# EAGLE design ArachnioDue (EAGLE 6.5.0)

## Sheet 1 of 4
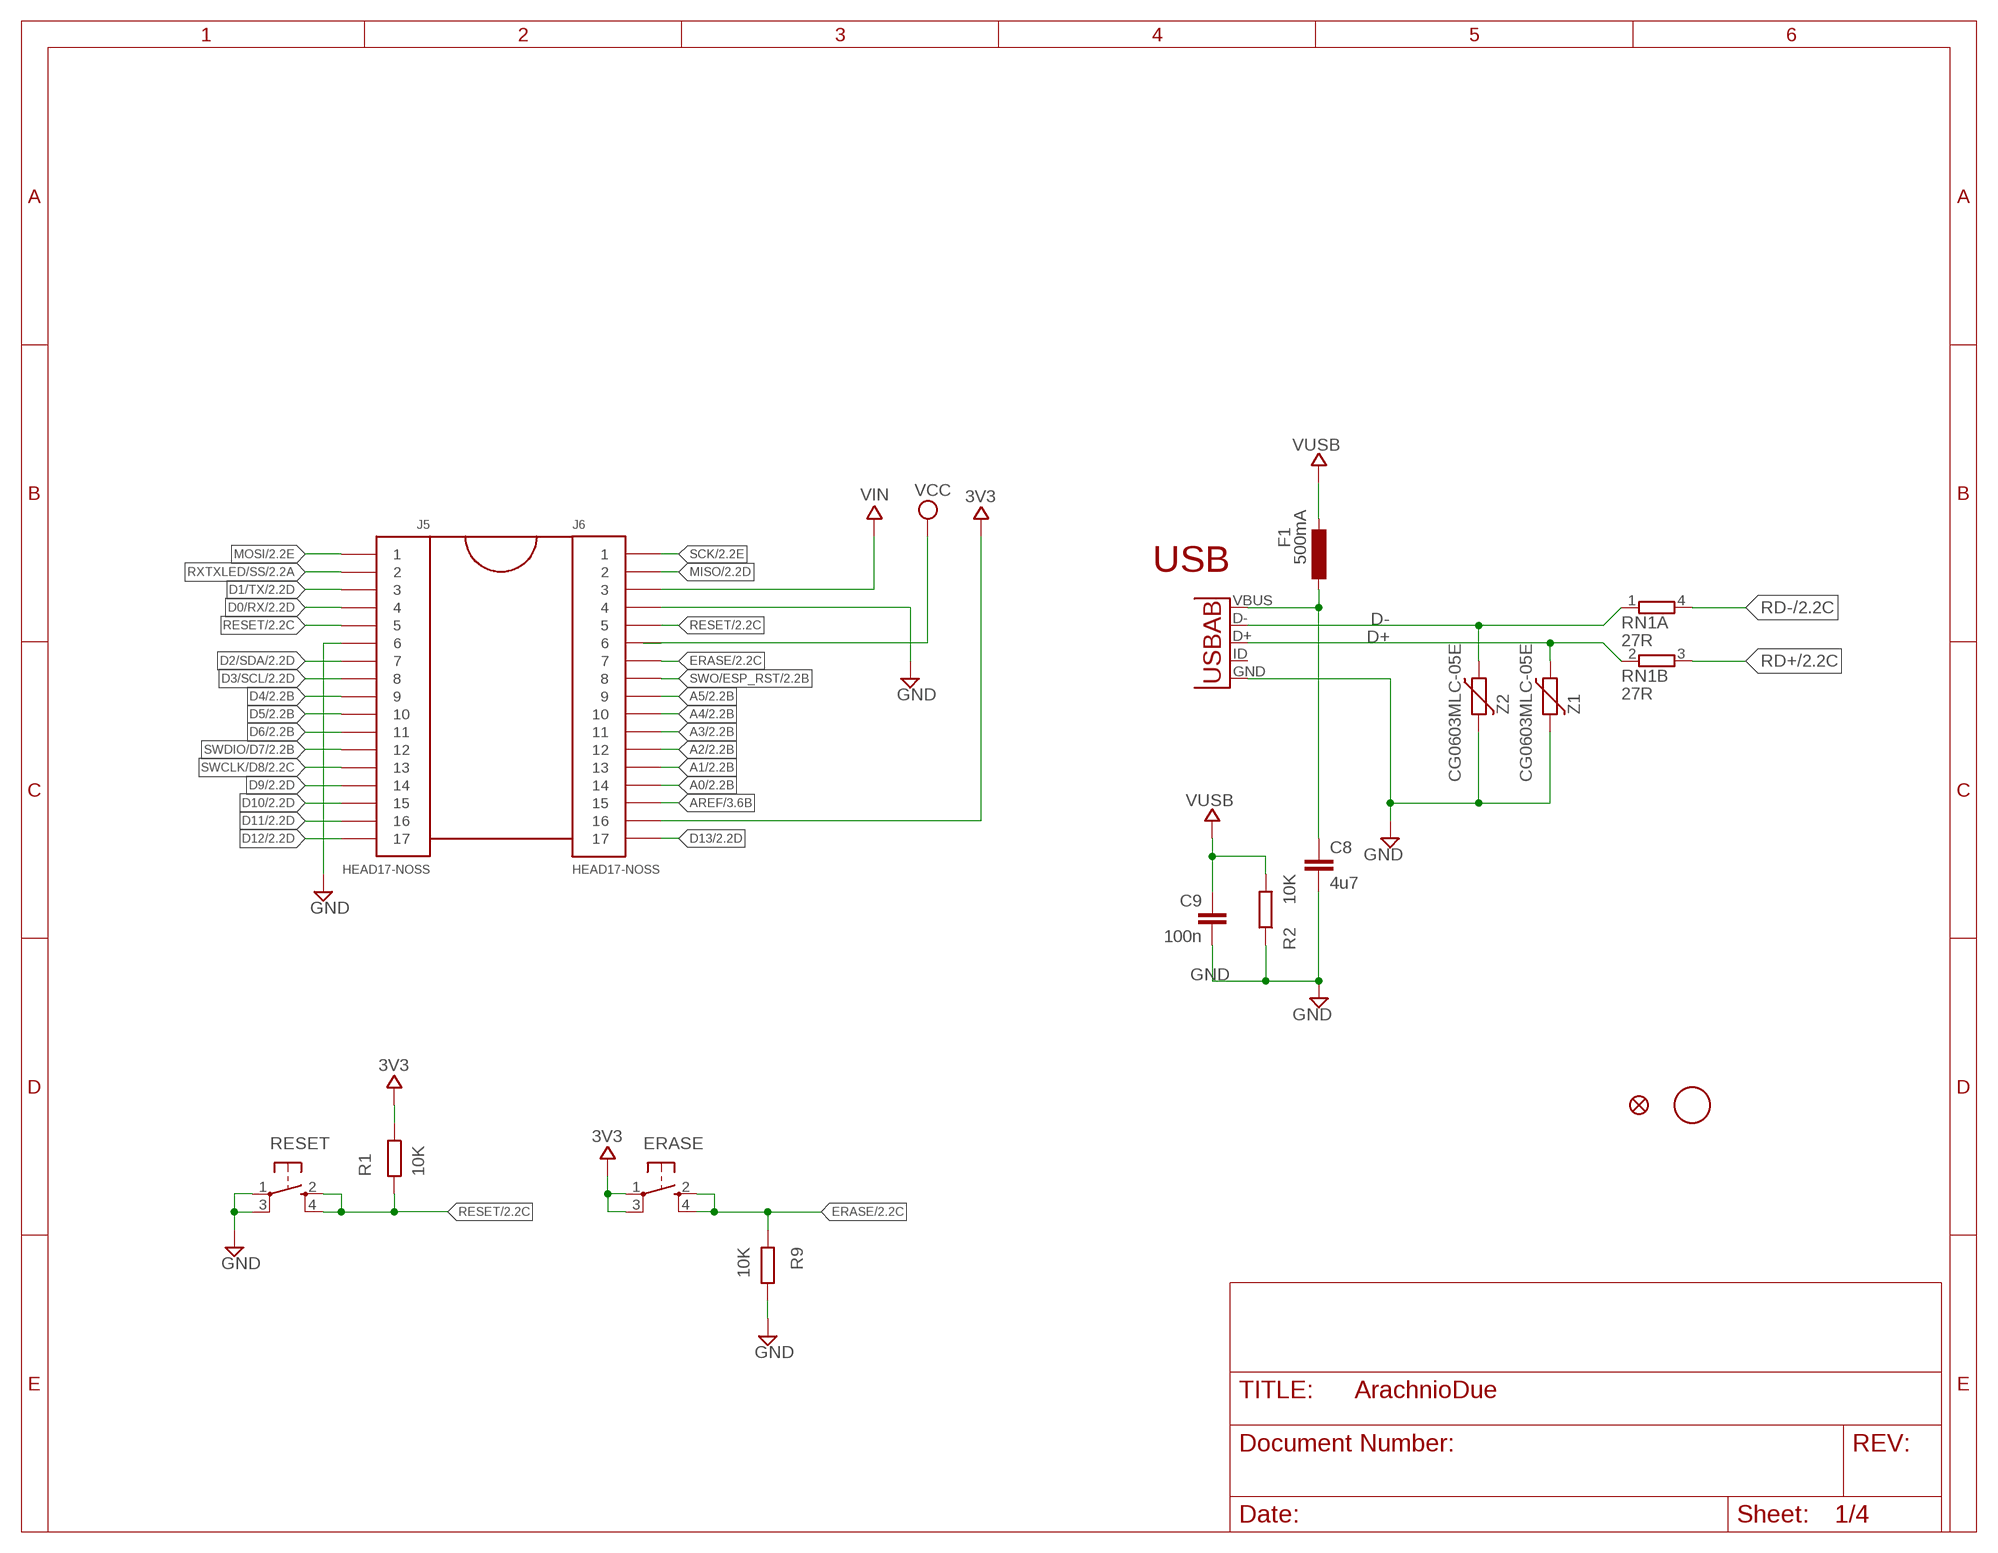
[diagram p0: schematic, sheet 1]

### Parts
C8  4u7  C-EUC0603  [C0603]
C9  100n  C-EUC0603  [C0603]
CN1  USB-AB  [USB-AB-MICRO-SMD]
ERASE  SPST_TACT-KMR2  [KMR2]
F1  500mA  L-EUL1812  [L1812]
J5  HEAD17-NOSS  [HEAD17-NOSS]
J6  HEAD17-NOSS  HEAD17-NOSS-1  [HEAD17-NOSS-1]
R1  10K  R-EU_R0402  [R0402]
R2  10K  R-EU_R0402  [R0402]
R9  10K  R-EU_R0402  [R0402]
RESET  SPST_TACT-KMR2  [KMR2]
RN1  27R  2R-NEXBV4V  [EXBV4V]
U$37  FIDUCIALMOUNT  [FIDUCIA-MOUNT]
U$53  FIDUCIAL1X2  [FIDUCIAL-1X2]
Z1  CG0603MLC-05E  VARISTORCN0603  [CT/CN0603]
Z2  CG0603MLC-05E  VARISTORCN0603  [CT/CN0603]

### Nets
3V3: ERASE.1(P) ERASE.3(P1) J6.16 R1.1 ; also sheet 2,3,4
A0: J6.14 ; also sheet 2
A1: J6.13 ; also sheet 2
A2: J6.12 ; also sheet 2
A3: J6.11 ; also sheet 2
A4: J6.10 ; also sheet 2
A5: J6.9 ; also sheet 2
AREF: J6.15 ; also sheet 3
D0/RX: J5.4 ; also sheet 2,4
D1/TX: J5.3 ; also sheet 2,4
D2/SDA: J5.7 ; also sheet 2
D3/SCL: J5.8 ; also sheet 2,4
D4: J5.9 ; also sheet 2
D5: J5.10 ; also sheet 2
D6: J5.11 ; also sheet 2
D9: J5.14 ; also sheet 2
D10: J5.15 ; also sheet 2
D11: J5.16 ; also sheet 2
D12: J5.17 ; also sheet 2
D13: J6.17 ; also sheet 2
D+: CN1.D+ RN1.2 Z1.1
D-: CN1.D- RN1.1 Z2.1
ERASE: ERASE.2(S) ERASE.4(S1) J6.7 R9.2 ; also sheet 2
GND: C8.2 C9.2 CN1.GND J5.6 J6.4 R2.1 R9.1 RESET.1(P) RESET.3(P1) Z1.2 Z2.2 ; also sheet 2,3,4
MISO: J6.2 ; also sheet 2
MOSI: J5.1 ; also sheet 2
RD+: RN1.3 ; also sheet 2
RD-: RN1.4 ; also sheet 2
RESET: J5.5 J6.5 R1.2 RESET.2(S) RESET.4(S1) ; also sheet 2,4
RXTXLED/SS: J5.2 ; also sheet 2
SCK: J6.1 ; also sheet 2
SWCLK/D8: J5.13 ; also sheet 2
SWDIO/D7: J5.12 ; also sheet 2
SWO/ESP_RST: J6.8 ; also sheet 2,4
VCC: J6.6 ; also sheet 3
VIN: J6.3 ; also sheet 3
VUSB: C9.1 F1.2 R2.2 ; also sheet 3
VUSBD: C8.1 CN1.VBUS F1.1
Unconnected: CN1.ID(USBID)

### Notes on the sheet
- USB

## Sheet 2 of 4
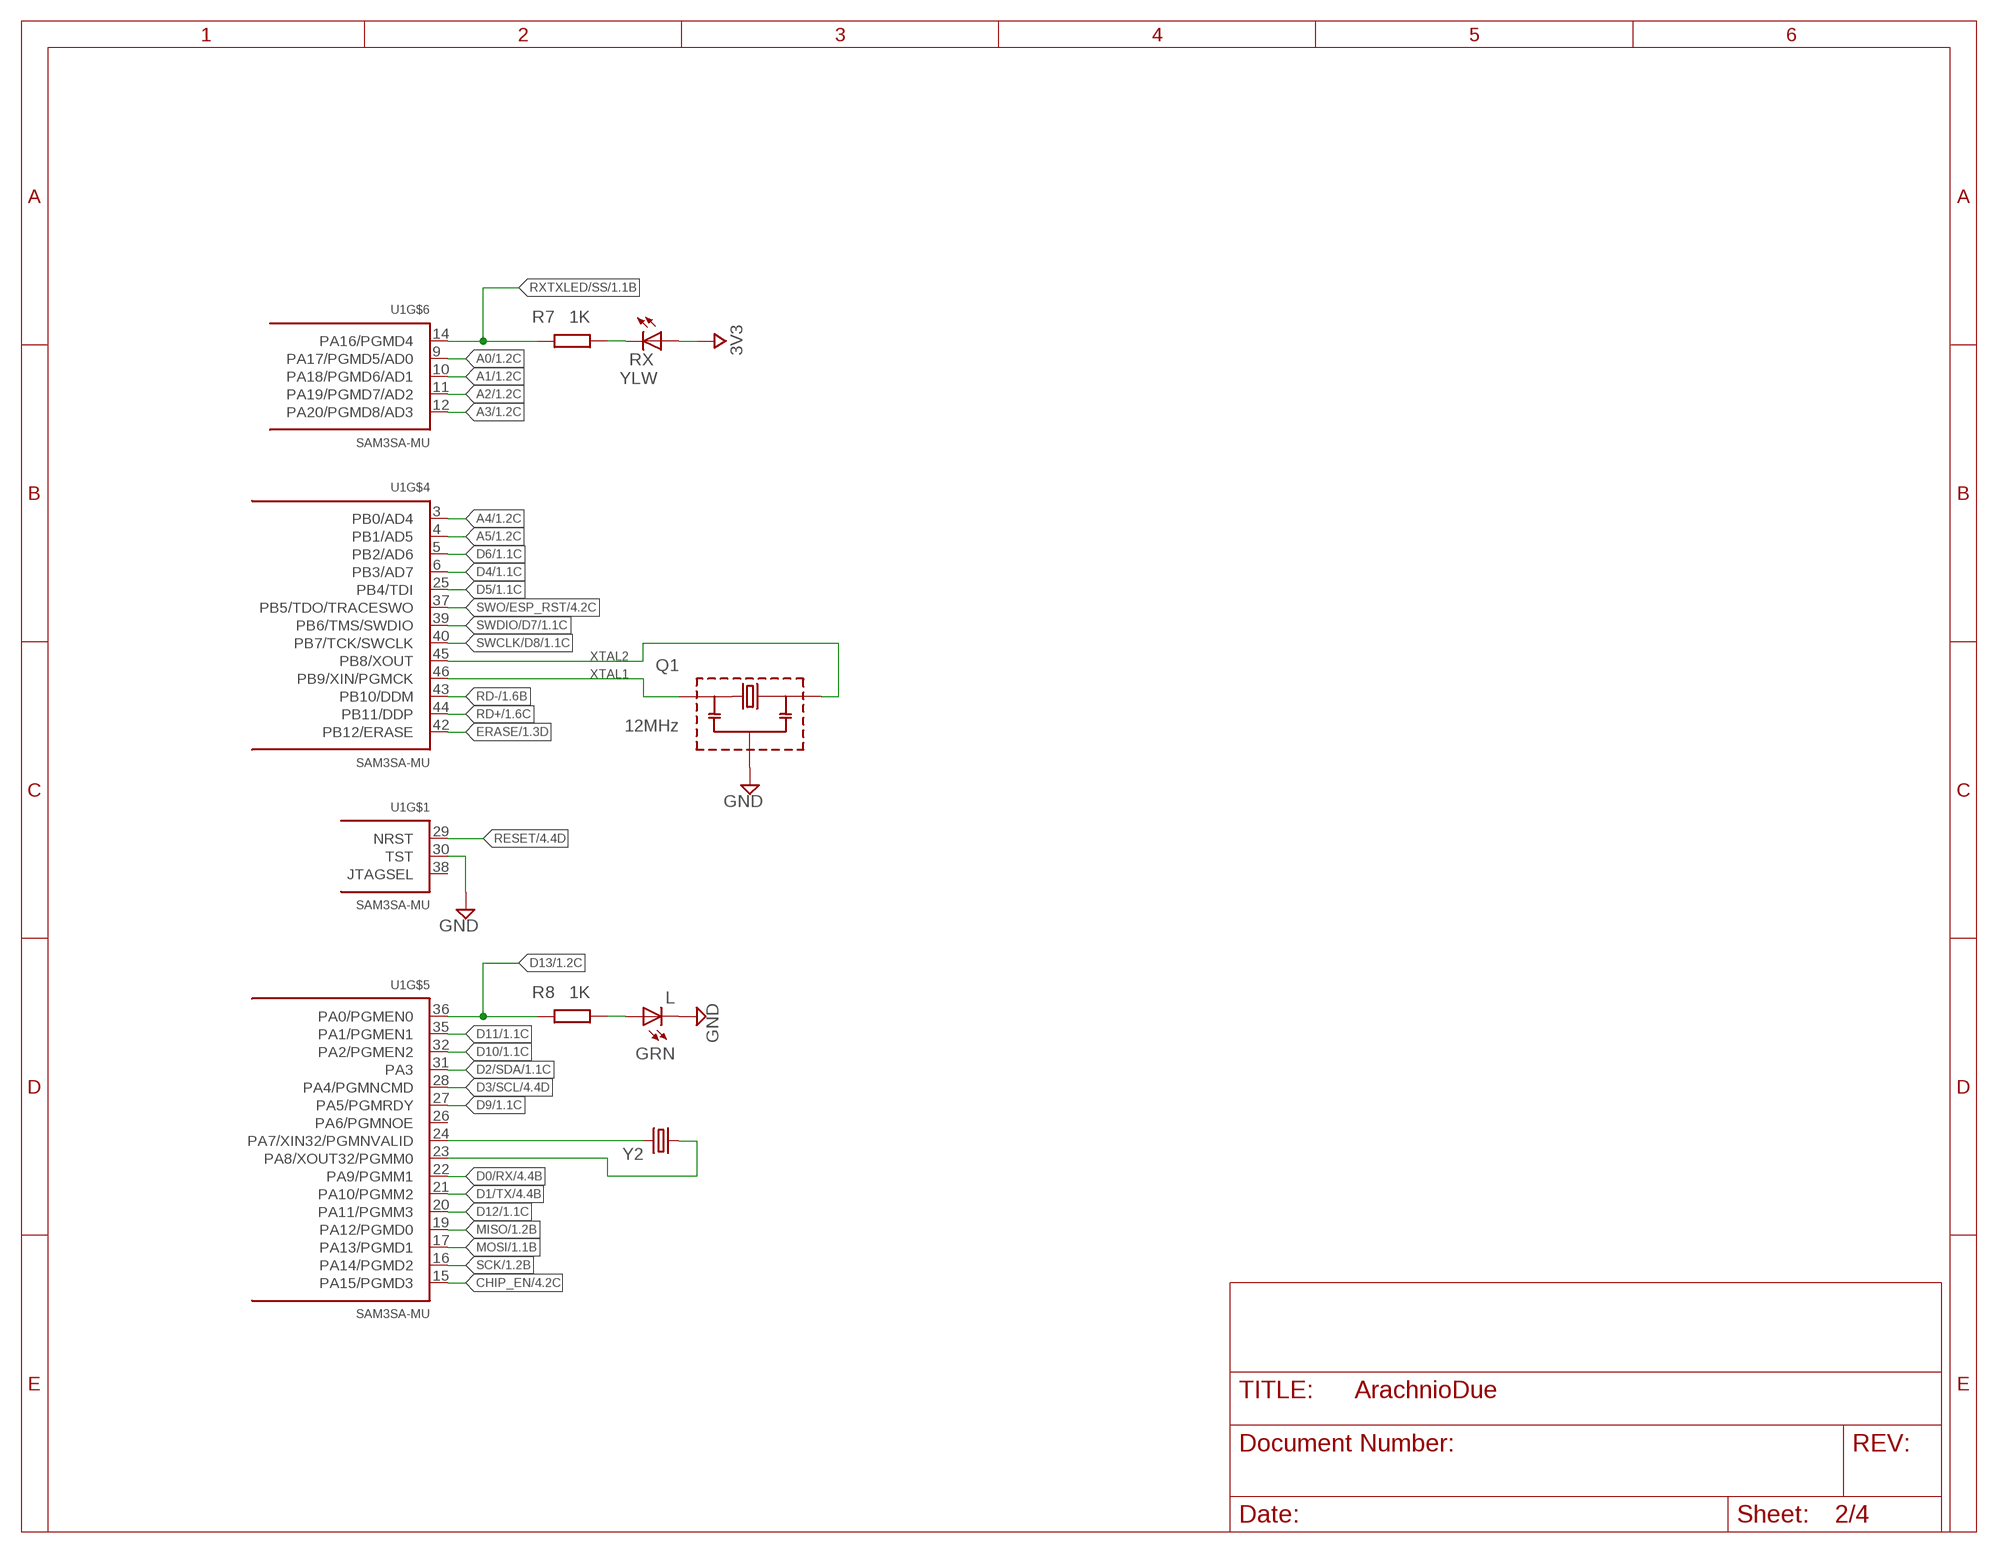
[diagram p1: schematic, sheet 2]

### Parts
L  GRN  LEDCHIP-LED0603  [CHIP-LED0603]
Q1  12MHz  PRQC  [PRQC]
R7  1K  R-EU_R0402  [R0402]
R8  1K  R-EU_R0402  [R0402]
RX  YLW  LEDCHIP-LED0603  [CHIP-LED0603]
U1  SAM3SA-MU  [QFN48]
Y2  CRYSTALEPSONMC146  [CRYSTAL-32KHZ-SMD_EPSON_MC146]

### Nets
3V3: RX.A ; also sheet 1,3,4
A0: U1.9(PA17/PGMD5/AD0) ; also sheet 1
A1: U1.10(PA18/PGMD6/AD1) ; also sheet 1
A2: U1.11(PA19/PGMD7/AD2) ; also sheet 1
A3: U1.12(PA20/PGMD8/AD3) ; also sheet 1
A4: U1.3(PB0/AD4) ; also sheet 1
A5: U1.4(PB1/AD5) ; also sheet 1
CHIP_EN: U1.15(PA15/PGMD3) ; also sheet 4
D0/RX: U1.22(PA9/PGMM1) ; also sheet 1,4
D1/TX: U1.21(PA10/PGMM2) ; also sheet 1,4
D2/SDA: U1.31(PA3) ; also sheet 1
D3/SCL: U1.28(PA4/PGMNCMD) ; also sheet 1,4
D4: U1.6(PB3/AD7) ; also sheet 1
D5: U1.25(PB4/TDI) ; also sheet 1
D6: U1.5(PB2/AD6) ; also sheet 1
D9: U1.27(PA5/PGMRDY) ; also sheet 1
D10: U1.32(PA2/PGMEN2) ; also sheet 1
D11: U1.35(PA1/PGMEN1) ; also sheet 1
D12: U1.20(PA11/PGMM3) ; also sheet 1
D13: R8.1 U1.36(PA0/PGMEN0) ; also sheet 1
ERASE: U1.42(PB12/ERASE) ; also sheet 1
GND: L.C Q1.P$2 U1.30(TST) ; also sheet 1,3,4
MISO: U1.19(PA12/PGMD0) ; also sheet 1
MOSI: U1.17(PA13/PGMD1) ; also sheet 1
N$1: U1.23(PA8/XOUT32/PGMM0) Y2.P$2
N$2: R7.2 RX.C
N$5: U1.24(PA7/XIN32/PGMNVALID) Y2.P$1
N$7: L.A R8.2
RD+: U1.44(PB11/DDP) ; also sheet 1
RD-: U1.43(PB10/DDM) ; also sheet 1
RESET: U1.29(NRST) ; also sheet 1,4
RXTXLED/SS: R7.1 U1.14(PA16/PGMD4) ; also sheet 1
SCK: U1.16(PA14/PGMD2) ; also sheet 1
SWCLK/D8: U1.40(PB7/TCK/SWCLK) ; also sheet 1
SWDIO/D7: U1.39(PB6/TMS/SWDIO) ; also sheet 1
SWO/ESP_RST: U1.37(PB5/TDO/TRACESWO) ; also sheet 1,4
XTAL1: Q1.P$3 U1.46(PB9/XIN/PGMCK)
XTAL2: Q1.P$1 U1.45(PB8/XOUT)
Unconnected: U1.26(PA6/PGMNOE) U1.38(JTAGSEL)

## Sheet 3 of 4
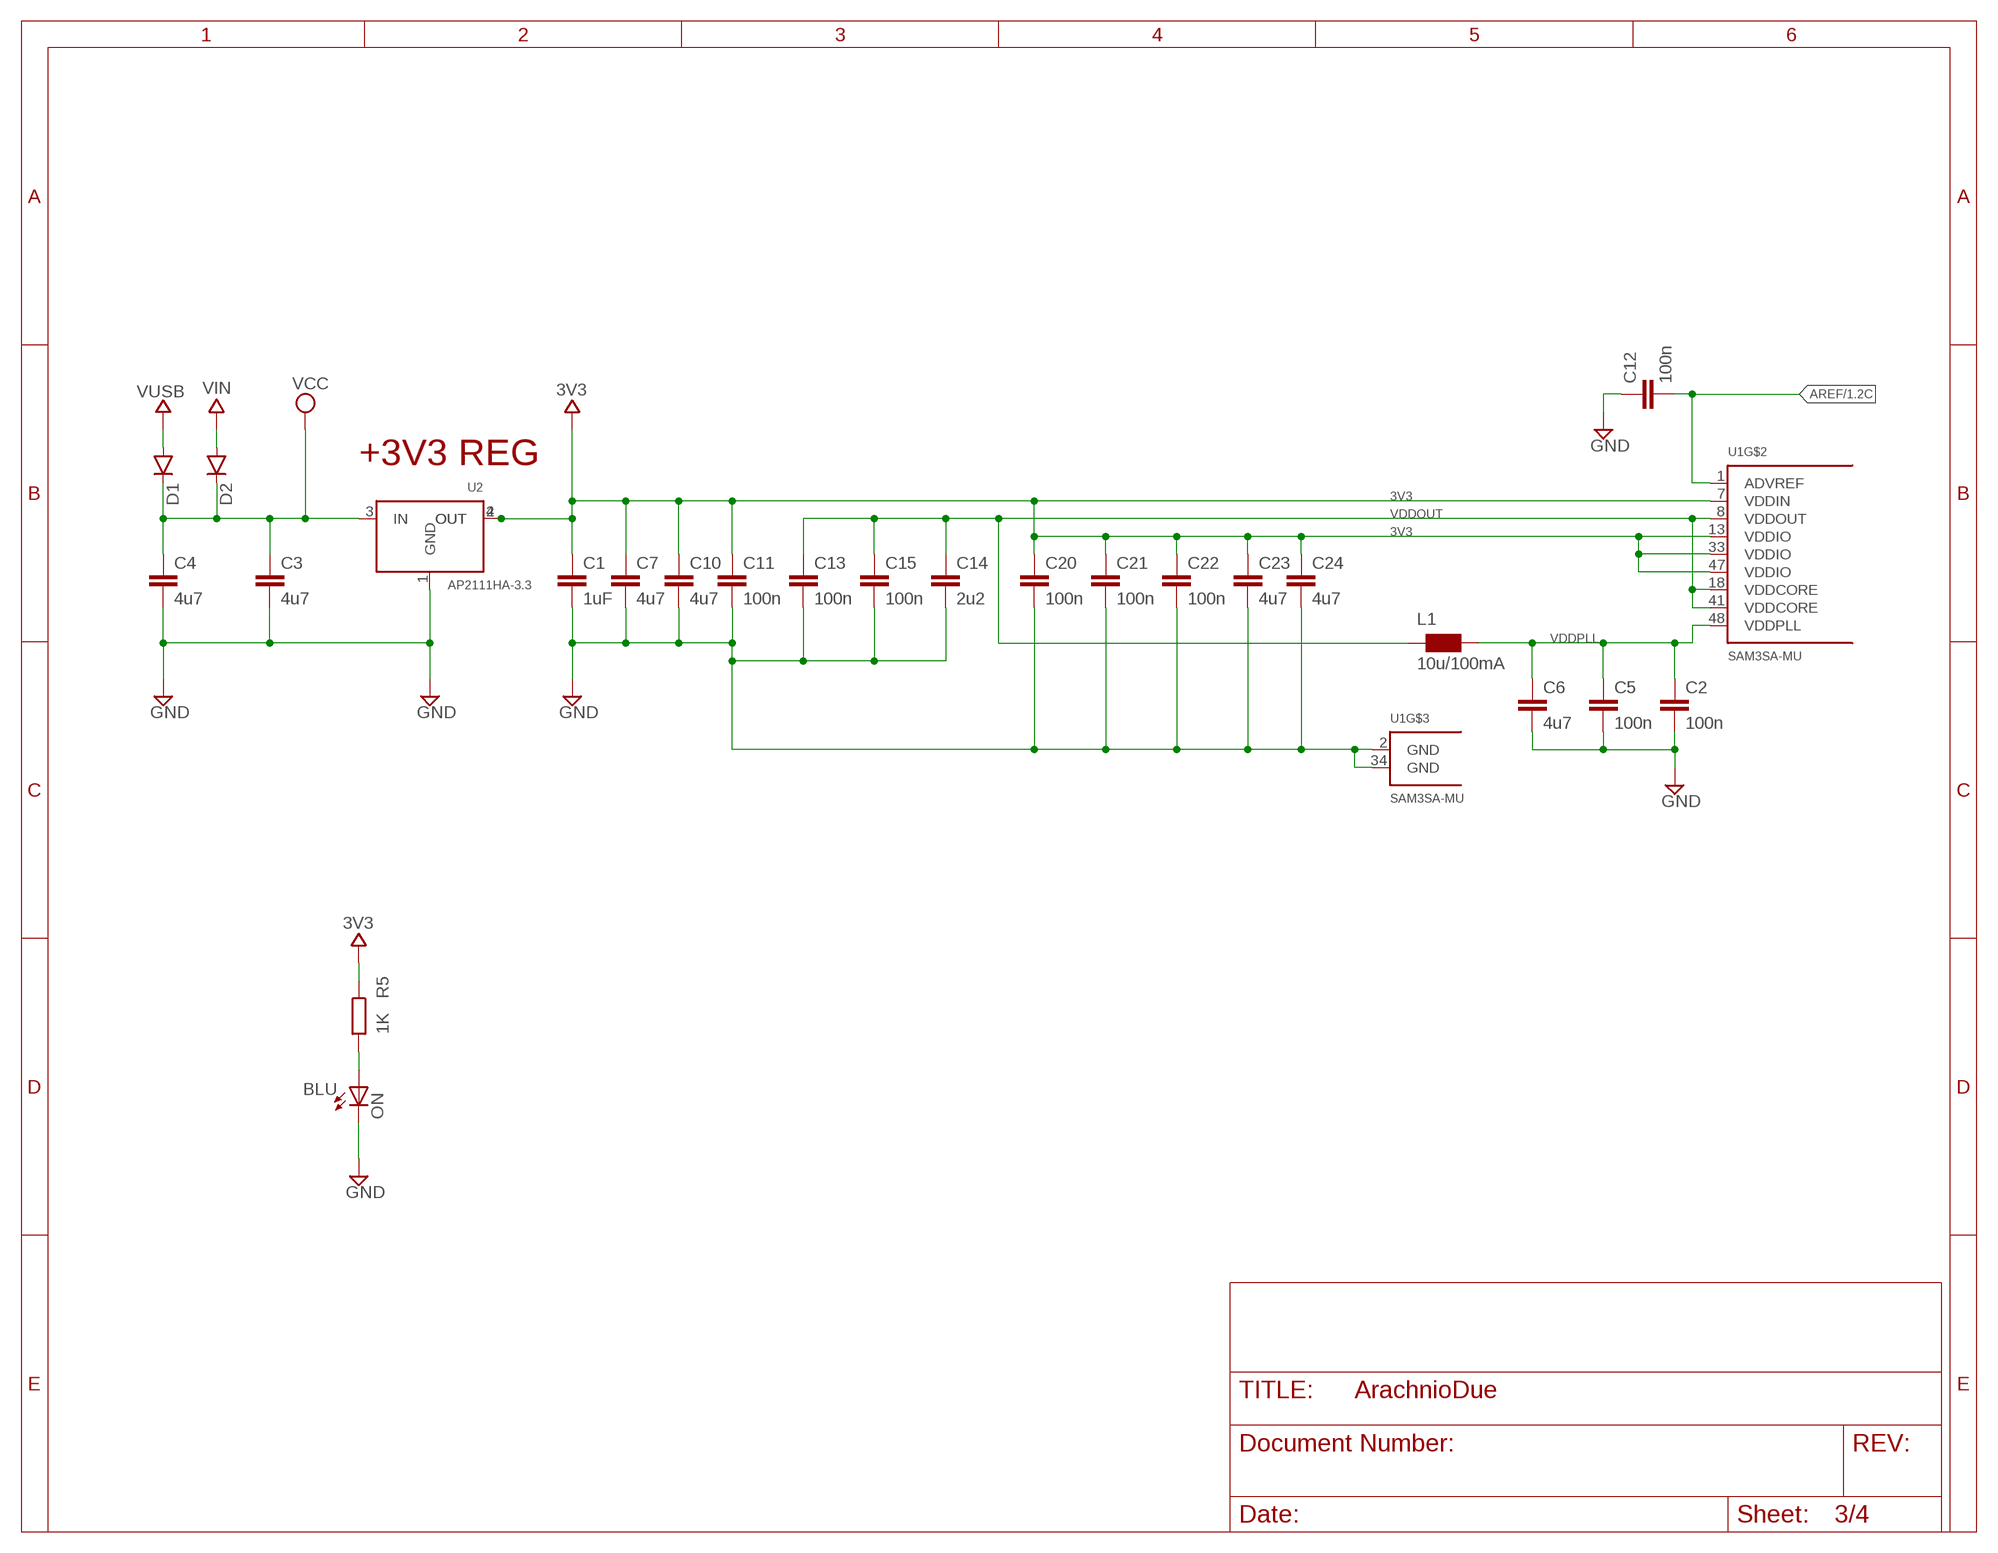
[diagram p2: schematic, sheet 3]

### Parts
C1  1uF  C-EUC0603  [C0603]
C2  100n  C-EUC0402  [C0402]
C3  4u7  C-EUC0603  [C0603]
C4  4u7  C-EUC0603  [C0603]
C5  100n  C-EUC0402  [C0402]
C6  4u7  C-EUC0603  [C0603]
C7  4u7  C-EUC0603  [C0603]
C10  4u7  C-EUC0603  [C0603]
C11  100n  C-EUC0402  [C0402]
C12  100n  C-EUC0402  [C0402]
C13  100n  C-EUC0402  [C0402]
C14  2u2  C-EUC0603  [C0603]
C15  100n  C-EUC0402  [C0402]
C20  100n  C-EUC0402  [C0402]
C21  100n  C-EUC0402  [C0402]
C22  100n  C-EUC0402  [C0402]
C23  4u7  C-EUC0603  [C0603]
C24  4u7  C-EUC0603  [C0603]
D1  DIODESOD123  [SOD-123]
D2  DIODESOD123  [SOD-123]
L1  10u/100mA  WE-CBF_0805  [0805]
ON  BLU  LEDCHIP-LED0603  [CHIP-LED0603]
R5  1K  R-EU_R0402  [R0402]
U2  AP2111HA-3.3  [SOT223]

### Nets
3V3: C1.1 C7.1 C10.1 C11.1 C20.1 C21.1 C22.1 C23.1 C24.1 R5.1 U1.7(VDDIN) U1.13(VDDIO) U1.33(VDDIO) U1.47(VDDIO) U2.2(OUT) U2.4(OUT) ; also sheet 1,2,4
AREF: C12.2 U1.1(ADVREF) ; also sheet 1
GND: C1.2 C2.2 C3.2 C4.2 C5.2 C6.2 C7.2 C10.2 C11.2 C12.1 C13.2 C14.2 C15.2 C20.2 C21.2 C22.2 C23.2 C24.2 ON.C U1.2(GND) U1.34(GND) U2.1(GND) ; also sheet 1,2,4
N$3: ON.A R5.2
VCC: C3.1 C4.1 D1.C D2.C U2.3(IN) ; also sheet 1
VDDOUT: C13.1 C14.1 C15.1 L1.1 U1.8(VDDOUT) U1.18(VDDCORE) U1.41(VDDCORE)
VDDPLL: C2.1 C5.1 C6.1 L1.2 U1.48(VDDPLL)
VIN: D2.A ; also sheet 1
VUSB: D1.A ; also sheet 1

### Notes on the sheet
- +3V3 REG

## Sheet 4 of 4
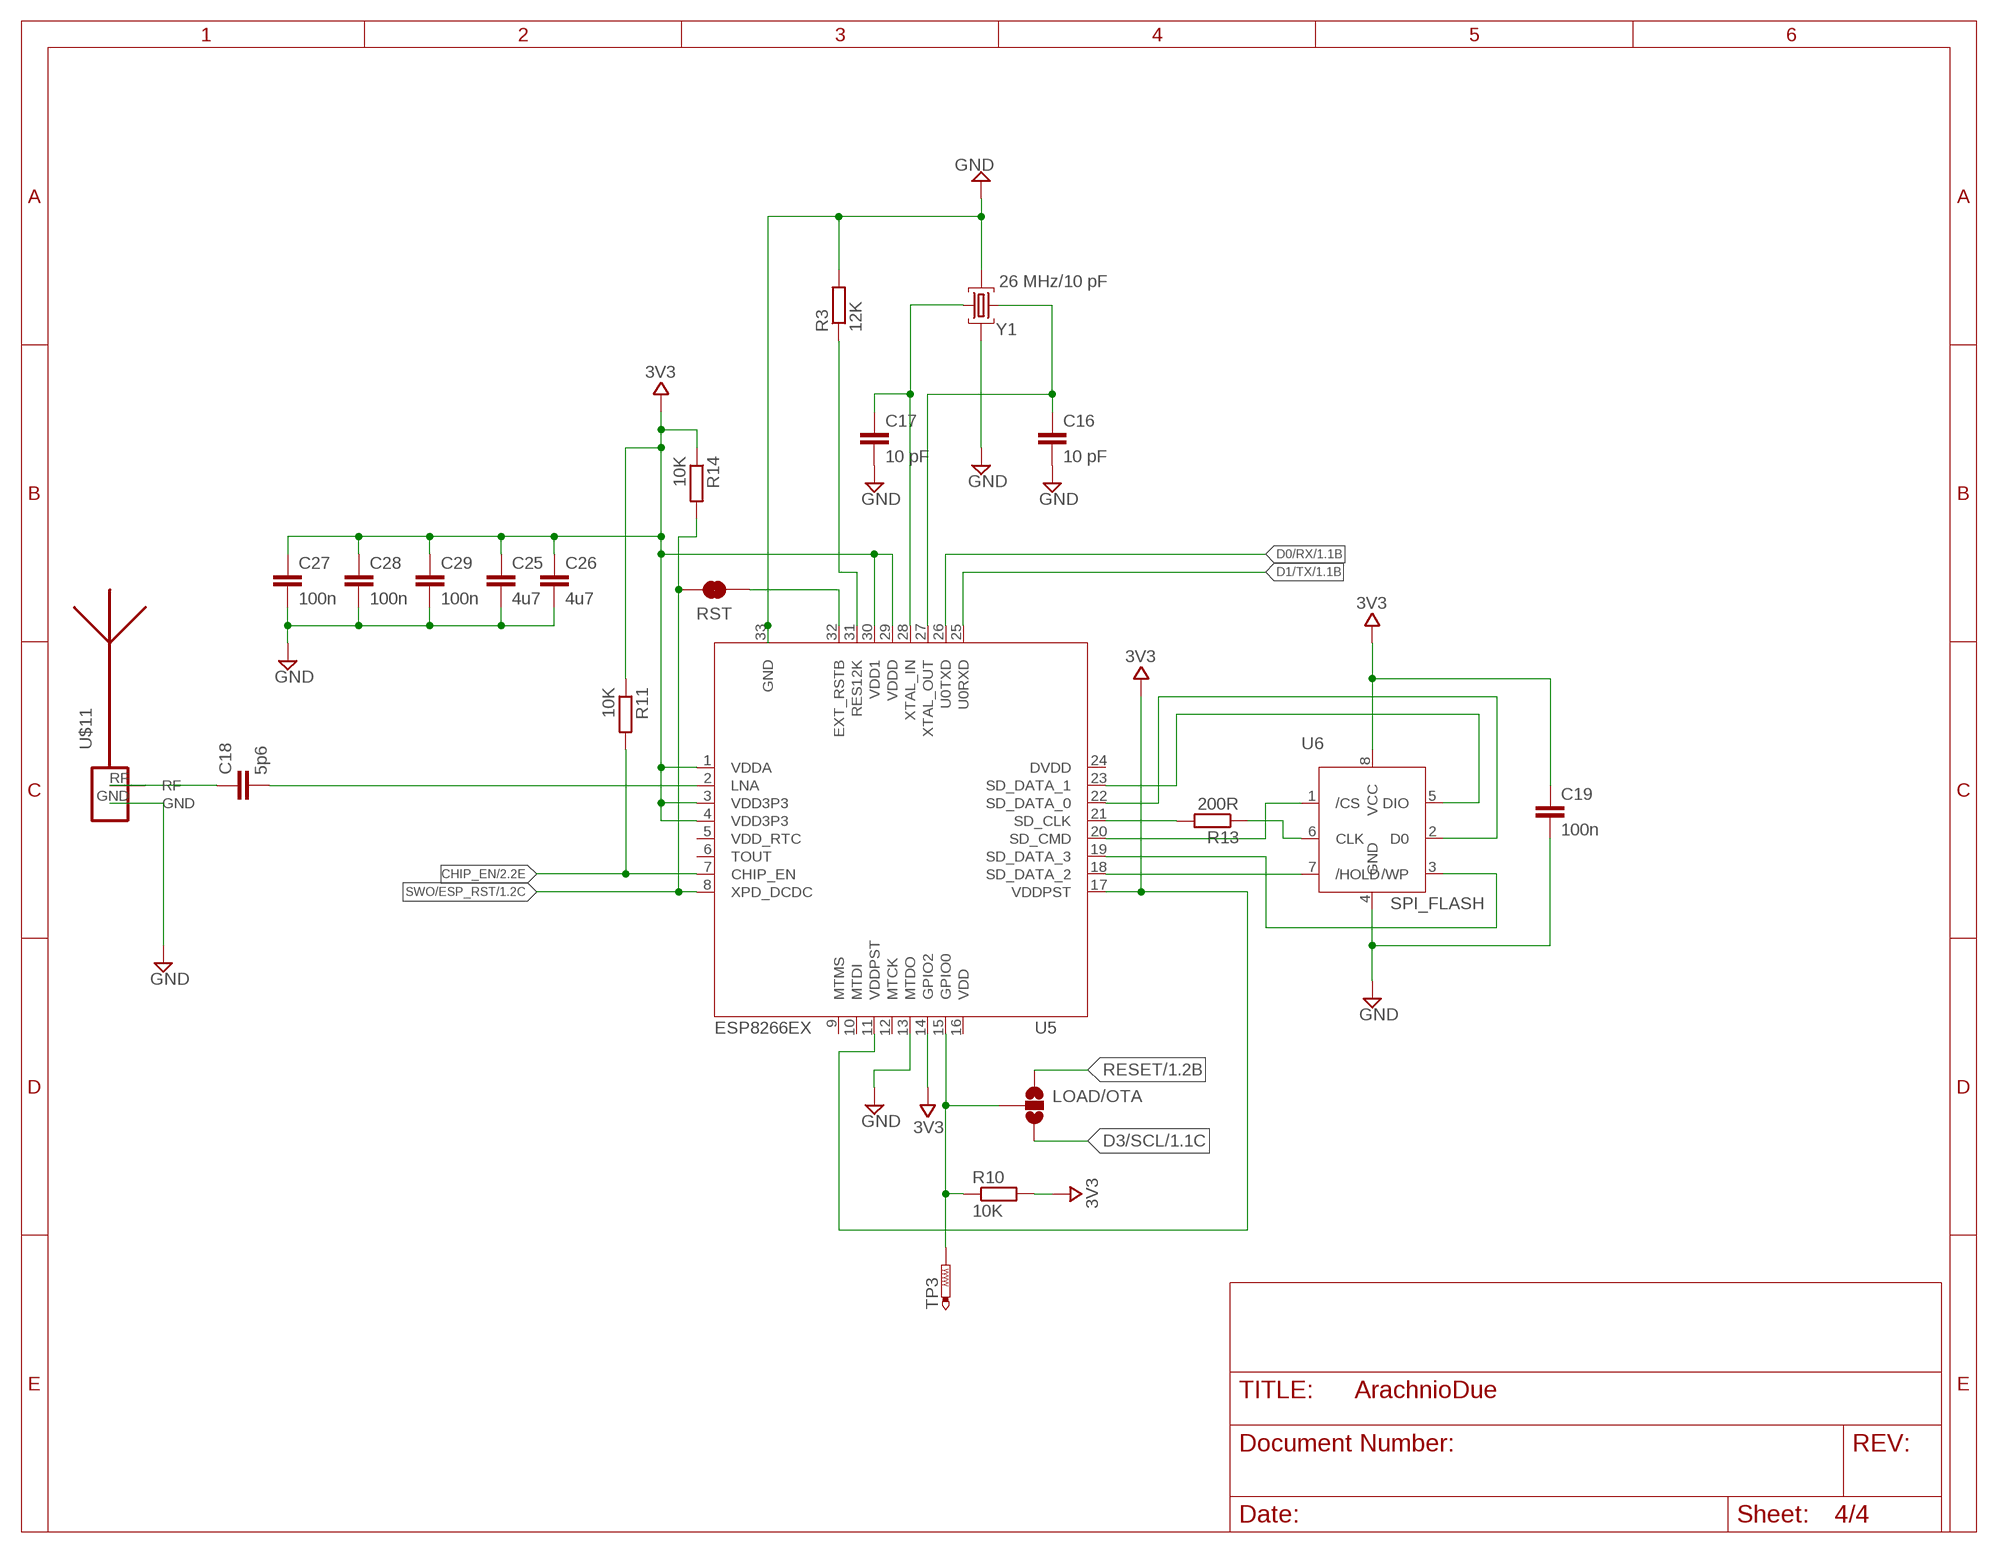
[diagram p3: schematic, sheet 4]

### Parts
C16  10 pF  C-EUC0402  [C0402]
C17  10 pF  C-EUC0402  [C0402]
C18  5p6  C-EUC0402  [C0402]
C19  100n  C-EUC0402  [C0402]
C25  4u7  C-EUC0603  [C0603]
C26  4u7  C-EUC0603  [C0603]
C27  100n  C-EUC0402  [C0402]
C28  100n  C-EUC0402  [C0402]
C29  100n  C-EUC0402  [C0402]
LOAD/OTA  JUMPER-PAD-3-NOYES_SILK  [PAD-JUMPER-3-NO_YES_SILK]
R3  12K  R-EU_R0402  [R0402]
R10  10K  R-EU_R0402  [R0402]
R11  10K  R-EU_R0402  [R0402]
R13  200R  R-EU_R0402  [R0402]
R14  10K  R-EU_R0402  [R0402]
RST  JUMPER-PAD-2-NC_BY_TRACE  [PAD-JUMPER-2-NC_BY_TRACE_YES_SILK]
TP3  PTR1TP15SQ  [TP15SQ]
U5  ESP8266EX  [QFN32]
U6  SPI_FLASH  [SOIC-8]
U$11  ANTENNA_1RIGHT  [SWRA117D_RIGHT]
Y1  26 MHz/10 pF  CRYSTAL-3.2-2.5  [CRYSTAL-3.2-2.5]

### Nets
3V3: C19.1 C25.1 C26.1 C27.1 C28.1 C29.1 R10.2 R11.1 R14.1 U5.1(VDDA) U5.3(VDD3P3) U5.4(VDD3P3) U5.11(VDDPST) U5.14(GPIO2) U5.17(VDDPST) U5.29(VDDD) U5.30(VDD1) U6.8(VCC) ; also sheet 1,2,3
CHIP_EN: R11.2 U5.7(CHIP_EN) ; also sheet 2
D0/RX: U5.26(U0TXD) ; also sheet 1,2
D1/TX: U5.25(U0RXD) ; also sheet 1,2
D3/SCL: LOAD/OTA.3 ; also sheet 1,2
GND: C16.2 C17.2 C19.2 C25.2 C26.2 C27.2 C28.2 C29.2 R3.2 U5.13(MTDO) U5.33(GND) U6.4(GND) U$11.GND Y1.2(GND) Y1.4(GND) ; also sheet 1,2,3
N$6: LOAD/OTA.2 R10.1 TP3.TP U5.15(GPIO0)
N$27: C17.1 U5.28(XTAL_IN) Y1.1(C1)
N$28: C16.1 U5.27(XTAL_OUT) Y1.3(C2)
N$31: C18.1 U$11.RF
N$32: R3.1 U5.31(RES12K)
N$33: RST.1 U5.32(EXT_RSTB)
N$34: R13.2 U5.21(SD_CLK)
N$35: R13.1 U6.6(CLK)
N$36: U5.20(SD_CMD) U6.1(/CS)
N$37: U5.18(SD_DATA_2) U6.7(/HOLD)
N$38: U5.19(SD_DATA_3) U6.3(/WP)
N$39: U5.23(SD_DATA_1) U6.5(DIO)
N$40: U5.22(SD_DATA_0) U6.2(D0)
N$45: C18.2 U5.2(LNA)
RESET: LOAD/OTA.1 ; also sheet 1,2
SWO/ESP_RST: R14.2 RST.2 U5.8(XPD_DCDC) ; also sheet 1,2
Unconnected: U5.6(TOUT) U5.9(MTMS) U5.10(MTDI) U5.12(MTCK)

## Power pins joined to a net without a drawn wire
DVDD: U5.24(DVDD)
VDD: U5.16(VDD)
VDD_RTC: U5.5(VDD_RTC)

## Library data of the parts
C1 = resistor:C-EU: CAPACITOR, European symbol; PARTNO: generic MLCC:1u/25V/0603
C2 C12 C19 = resistor:C-EU: CAPACITOR, European symbol; PARTNO: generic MLCC:100n/16V/0402
C3 C4 C8 = resistor:C-EU: CAPACITOR, European symbol; PARTNO: generic MLCC:4u7/25V/0603
C5 C11 C13 C15 C20-C22 C27-C29 = resistor:C-EU: CAPACITOR, European symbol; PARTNO: generic MLCC:100n/16V/0402; VOLTAGE: 16V
C6 C7 C10 C23-C26 = resistor:C-EU: CAPACITOR, European symbol; PARTNO: generic MLCC:4u7/10V/0603; VOLTAGE: 10V
C9 = resistor:C-EU: CAPACITOR, European symbol; PARTNO: generic MLCC:100n/50V/0603
C14 = resistor:C-EU: CAPACITOR, European symbol; PARTNO: generic MLCC:2u2/6V3/0603; VOLTAGE: 6V3
C16-C18 = resistor:C-EU: CAPACITOR, European symbol
CN1 = SparkFun-Connectors:USB-AB: This is a USB AB connector that is compatible with USB OTG. i.e. this connector can serve as a host or device; PARTNO: 10104111-0001LF
D1 D2 = SparkFun-DiscreteSemi:DIODE: Diode These are standard reverse protection diodes and small signal diodes. SMA package can handle up to about 1A. SOD-323 can handle about 200mA. What the SOD-323 package when ordering, there are some mfgs out there that are 5-pin packages.; PARTNO: CDBW140-G
ERASE RESET = adafruit:SPST_TACT: SMT 6mm switch, EVQQ2 series http://www.ladyada.net/library/eagle; PARTNO: KMR221NG
F1 = rcl:L-EU: INDUCTOR, European symbol; PARTNO: MF-MSMF050-2
J5 = SmartPrj:HEAD17-NOSS; BOM: EXCLUDE; PARTNO: PREC017SAAN-RC
J6 = SmartPrj:HEAD17-NOSS-1; BOM: EXCLUDE; PARTNO: PREC017SAAN-RC
L = led:LED: LED OSRAM: - CHIPLED LG R971, LG N971, LY N971, LG Q971, LY Q971, LO R971, LY R971 LH N974, LH R974 LS Q976, LO Q976, LY Q976 LO Q996 - Hyper CHIPLED LW Q18S LB Q993, LB Q99A, LB R99A - SideLED LS A670, LO A670, LY A670, LG A670, LP A670 LB A673, LV A673, LT A673, LW A673 LH A674 LY A675 LS A676, LA A676, LO A676, LY A676, LW A676 LS A679, LY A679, LG A679 - Hyper Micro SIDELED® LS Y876, LA Y876, LO Y876, LY Y876 LT Y87S - SmartLED LW L88C, LW L88S LB L89C, LB L89S, LG L890 LS L89K, LO L89K, LY L89K LS L896, LA L896, LO L896, LY L896 - TOPLED LS T670, LO T670, LY T670, LG T670, LP T670 LSG T670, LSP T670, LSY T670, LOP T670, LYG T670 LG T671, LOG T671, LSG T671 LB T673, LV T673, LT T673, LW T673 LH T674 LS T676, LA T676, LO T676, LY T676, LB T676, LH T676, LSB T676, LW T676 LB T67C, LV T67C, LT T67C, LS T67K, LO T67K, LY T67K, LW E67C LS E67B, LA E67B, LO E67B, LY E67B, LB E67C, LV E67C, LT E67C LW T67C LS T679, LY T679, LG T679 LS T770, LO T770, LY T770, LG T770, LP T770 LB T773, LV T773, LT T773, LW T773 LH T774 LS E675, LA E675, LY E675, LS T675 LS T776, LA T776, LO T776, LY T776, LB T776 LHGB T686 LT T68C, LB T68C - Hyper Mini TOPLED® LB M676 - Mini TOPLED Santana® LG M470 LS M47K, LO M47K, LY M47K Source: http://www.osram.convergy.de LUXEON: - LUMILED® LXK2-PW12-R00, LXK2-PW12-S00, LXK2-PW14-U00, LXK2-PW14-V00 LXK2-PM12-R00, LXK2-PM12-S00, LXK2-PM14-U00 LXK2-PE12-Q00, LXK2-PE12-R00, LXK2-PE12-S00, LXK2-PE14-T00, LXK2-PE14-U00 LXK2-PB12-K00, LXK2-PB12-L00, LXK2-PB12-M00, LXK2-PB14-N00, LXK2-PB14-P00, LXK2-PB14-Q00 LXK2-PR12-L00, LXK2-PR12-M00, LXK2-PR14-Q00, LXK2-PR14-R00 LXK2-PD12-Q00, LXK2-PD12-R00, LXK2-PD12-S00 LXK2-PH12-R00, LXK2-PH12-S00 LXK2-PL12-P00, LXK2-PL12-Q00, LXK2-PL12-R00 Source: www.luxeon.com KINGBRIGHT: KA-3528ASYC Source: www.kingbright.com; PARTNO: LTST-C191KGKT
L1 = wuerth-elektronik:WE-CBF: SMD EMI Suppression Ferrite Beads - excellent anti-EMI properties - low DCR - impedances till 3000 ohms - rated current up to 6 A; PARTNO: MLZ2012N100LT000
LOAD/OTA = SparkFun-Passives:JUMPER-PAD-3-NO; BOM: EXCLUDE
ON = led:LED: LED OSRAM: - CHIPLED LG R971, LG N971, LY N971, LG Q971, LY Q971, LO R971, LY R971 LH N974, LH R974 LS Q976, LO Q976, LY Q976 LO Q996 - Hyper CHIPLED LW Q18S LB Q993, LB Q99A, LB R99A - SideLED LS A670, LO A670, LY A670, LG A670, LP A670 LB A673, LV A673, LT A673, LW A673 LH A674 LY A675 LS A676, LA A676, LO A676, LY A676, LW A676 LS A679, LY A679, LG A679 - Hyper Micro SIDELED® LS Y876, LA Y876, LO Y876, LY Y876 LT Y87S - SmartLED LW L88C, LW L88S LB L89C, LB L89S, LG L890 LS L89K, LO L89K, LY L89K LS L896, LA L896, LO L896, LY L896 - TOPLED LS T670, LO T670, LY T670, LG T670, LP T670 LSG T670, LSP T670, LSY T670, LOP T670, LYG T670 LG T671, LOG T671, LSG T671 LB T673, LV T673, LT T673, LW T673 LH T674 LS T676, LA T676, LO T676, LY T676, LB T676, LH T676, LSB T676, LW T676 LB T67C, LV T67C, LT T67C, LS T67K, LO T67K, LY T67K, LW E67C LS E67B, LA E67B, LO E67B, LY E67B, LB E67C, LV E67C, LT E67C LW T67C LS T679, LY T679, LG T679 LS T770, LO T770, LY T770, LG T770, LP T770 LB T773, LV T773, LT T773, LW T773 LH T774 LS E675, LA E675, LY E675, LS T675 LS T776, LA T776, LO T776, LY T776, LB T776 LHGB T686 LT T68C, LB T68C - Hyper Mini TOPLED® LB M676 - Mini TOPLED Santana® LG M470 LS M47K, LO M47K, LY M47K Source: http://www.osram.convergy.de LUXEON: - LUMILED® LXK2-PW12-R00, LXK2-PW12-S00, LXK2-PW14-U00, LXK2-PW14-V00 LXK2-PM12-R00, LXK2-PM12-S00, LXK2-PM14-U00 LXK2-PE12-Q00, LXK2-PE12-R00, LXK2-PE12-S00, LXK2-PE14-T00, LXK2-PE14-U00 LXK2-PB12-K00, LXK2-PB12-L00, LXK2-PB12-M00, LXK2-PB14-N00, LXK2-PB14-P00, LXK2-PB14-Q00 LXK2-PR12-L00, LXK2-PR12-M00, LXK2-PR14-Q00, LXK2-PR14-R00 LXK2-PD12-Q00, LXK2-PD12-R00, LXK2-PD12-S00 LXK2-PH12-R00, LXK2-PH12-S00 LXK2-PL12-P00, LXK2-PL12-Q00, LXK2-PL12-R00 Source: www.luxeon.com KINGBRIGHT: KA-3528ASYC Source: www.kingbright.com; PARTNO: LB Q39G-L2N2-35-1
Q1 = logos-crystals:PRQC: PRQC series resonator from Kyocera; PARTNO: PRQC12.00CR1010V00L
R1 R2 R9-R11 R14 = resistor:R-EU_: RESISTOR, European symbol; PARTNO: generic resistor:10K/0402
R3 = resistor:R-EU_: RESISTOR, European symbol; PARTNO: generic resistor:12K/0402
R5 R7 R8 = resistor:R-EU_: RESISTOR, European symbol; PARTNO: generic resistor:1K/0402
R13 = resistor:R-EU_: RESISTOR, European symbol; PARTNO: generic resistor:200R/0402
RN1 = res-cap-arrays:2R-N: Array Chip Resistor Source: Panasonic; PARTNO: EXB-V4V270JV
RST = SparkFun-Passives:JUMPER-PAD-2-NC_BY_TRACE; BOM: EXCLUDE; PARTNO: MCR03ERTJ000
RX = led:LED: LED OSRAM: - CHIPLED LG R971, LG N971, LY N971, LG Q971, LY Q971, LO R971, LY R971 LH N974, LH R974 LS Q976, LO Q976, LY Q976 LO Q996 - Hyper CHIPLED LW Q18S LB Q993, LB Q99A, LB R99A - SideLED LS A670, LO A670, LY A670, LG A670, LP A670 LB A673, LV A673, LT A673, LW A673 LH A674 LY A675 LS A676, LA A676, LO A676, LY A676, LW A676 LS A679, LY A679, LG A679 - Hyper Micro SIDELED® LS Y876, LA Y876, LO Y876, LY Y876 LT Y87S - SmartLED LW L88C, LW L88S LB L89C, LB L89S, LG L890 LS L89K, LO L89K, LY L89K LS L896, LA L896, LO L896, LY L896 - TOPLED LS T670, LO T670, LY T670, LG T670, LP T670 LSG T670, LSP T670, LSY T670, LOP T670, LYG T670 LG T671, LOG T671, LSG T671 LB T673, LV T673, LT T673, LW T673 LH T674 LS T676, LA T676, LO T676, LY T676, LB T676, LH T676, LSB T676, LW T676 LB T67C, LV T67C, LT T67C, LS T67K, LO T67K, LY T67K, LW E67C LS E67B, LA E67B, LO E67B, LY E67B, LB E67C, LV E67C, LT E67C LW T67C LS T679, LY T679, LG T679 LS T770, LO T770, LY T770, LG T770, LP T770 LB T773, LV T773, LT T773, LW T773 LH T774 LS E675, LA E675, LY E675, LS T675 LS T776, LA T776, LO T776, LY T776, LB T776 LHGB T686 LT T68C, LB T68C - Hyper Mini TOPLED® LB M676 - Mini TOPLED Santana® LG M470 LS M47K, LO M47K, LY M47K Source: http://www.osram.convergy.de LUXEON: - LUMILED® LXK2-PW12-R00, LXK2-PW12-S00, LXK2-PW14-U00, LXK2-PW14-V00 LXK2-PM12-R00, LXK2-PM12-S00, LXK2-PM14-U00 LXK2-PE12-Q00, LXK2-PE12-R00, LXK2-PE12-S00, LXK2-PE14-T00, LXK2-PE14-U00 LXK2-PB12-K00, LXK2-PB12-L00, LXK2-PB12-M00, LXK2-PB14-N00, LXK2-PB14-P00, LXK2-PB14-Q00 LXK2-PR12-L00, LXK2-PR12-M00, LXK2-PR14-Q00, LXK2-PR14-R00 LXK2-PD12-Q00, LXK2-PD12-R00, LXK2-PD12-S00 LXK2-PH12-R00, LXK2-PH12-S00 LXK2-PL12-P00, LXK2-PL12-Q00, LXK2-PL12-R00 Source: www.luxeon.com KINGBRIGHT: KA-3528ASYC Source: www.kingbright.com; PARTNO: LTST-C191KSKT
TP3 = testpad:PTR1: TEST PIN; BOM: EXCLUDE
U1 = atmel-sam3s:SAM3S*A; PARTNO: ATSAM4S2AA-MU
U2 = logos-power:AP2111HA; PARTNO: AP2111H-3.3TRG1
U5 = ESP8266:ESP8266: 802.11bgn Smart Device; PARTNO: ESP8266EX
U6 = ESP8266:SPI_FLASH: SPI Flash; PARTNO: SST25VF512A-33-4C-SAE
U$11 = ant-planar-1:ANTENNA_1; BOM: EXCLUDE; PARTNO: *
U$37 = SmartPrj:FIDUCIALMOUNT; BOM: EXCLUDE
U$53 = SparkFun:FIDUCIAL: Fiducial Alignment Points Various fiducial points for machine vision alignment.; BOM: EXCLUDE
Y1 = SmartPrj:CRYSTAL-3.2-2.5; PARTNO: 403C11A26M00000
Y2 = SparkFun-FreqCtrl:CRYSTAL: Various standard crystals. Proven footprints.; PARTNO: MC-146 32.768KA-AC3
Z1 Z2 = varistor:VARISTOR: VARISTOR; PARTNO: CG0603MLC-05E

## Net classes
0 default: width 0.127 mm, drill 0.254 mm, clearance 0.127 mm

## Board
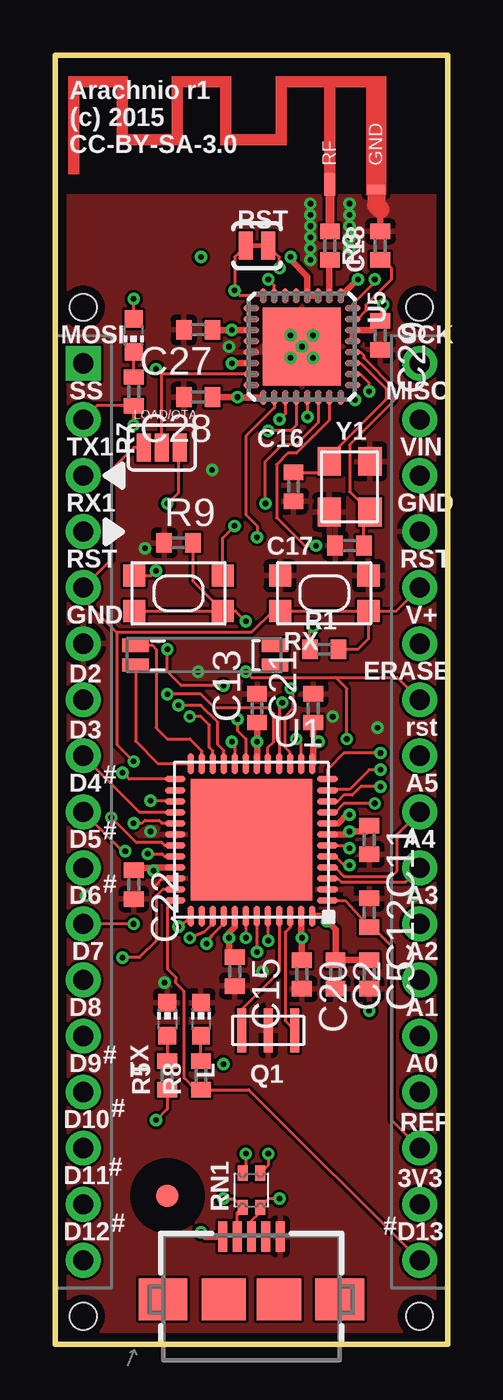
[diagram p4: board, top side]
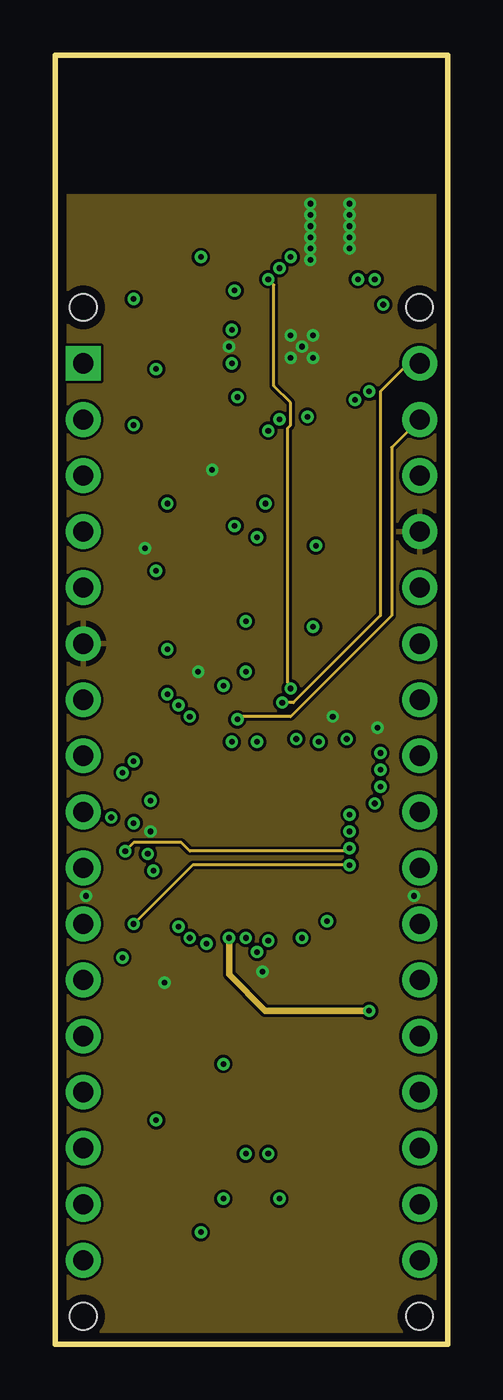
[diagram p5: board, inner layer GND]
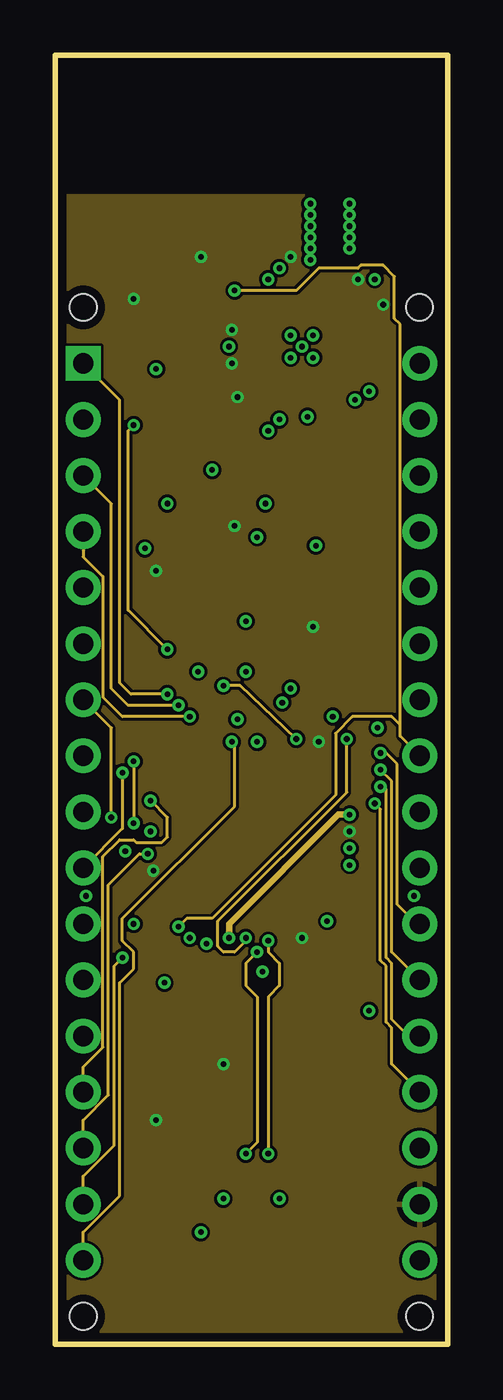
[diagram p6: board, inner layer PWR]
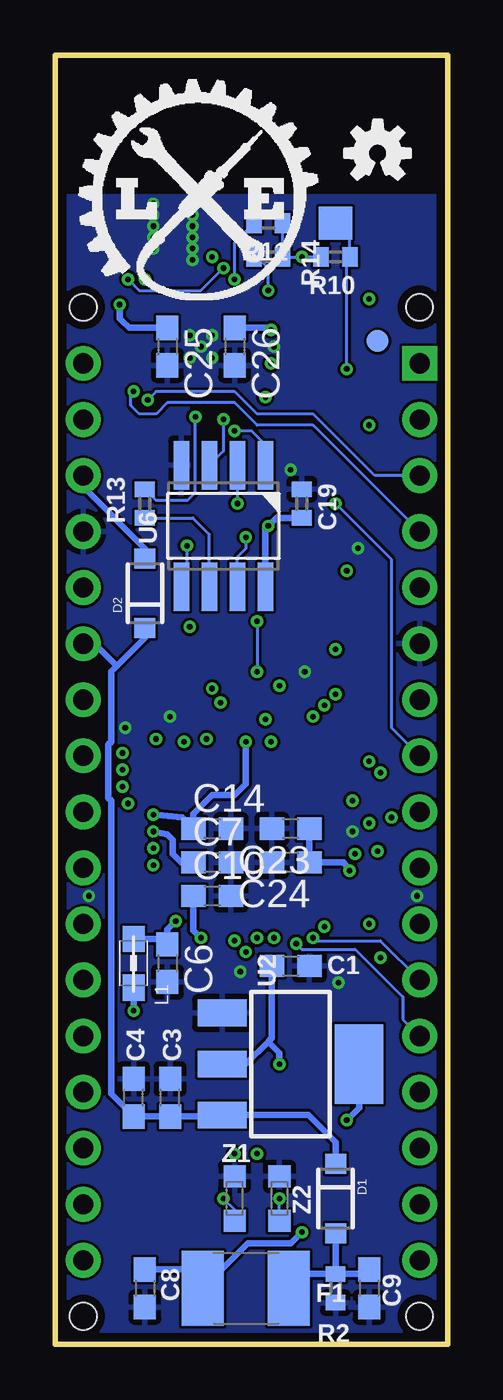
[diagram p7: board, bottom side, seen from below]

Size 17.78 x 58.42 mm. Coordinates in mm from the lower left corner, seen from the top.
Outline: 0,0 17.78,0 17.78,58.42 0,58.42 0,0
Copper layers (1*2*15*16): Top 0.0356mm / dielectric 1.5011mm / GND 0.0356mm / dielectric 0.1499mm / PWR 0.0356mm / dielectric 0.2007mm / Bottom 0.0356mm
Design rules "4layer-proto *": minimum track width 5mil, minimum drill 10mil, track to track 5mil, track to pad 5mil, pad to pad 5mil, via to via 5mil, smd to smd 5mil, copper to edge 15mil, drill to drill 5mil, minimum pad ring 6mil, minimum via ring 6mil, stop-mask expansion 4mil, vias tented up to drill 15mil, thermal gap 10mil
Holes 1.2 mm at 1.27,1.27 16.51,1.27 1.27,46.99 16.51,46.99

### Footprints (pad centres in the part's own frame; a part is rotated, then mirrored left to right if it is on the bottom)
C0603 = smd 1.1 x 1: 1 -0.85,0; 2 0.85,0
C0402 = smd 0.7 x 0.9: 1 -0.65,0; 2 0.65,0
USB-AB-MICRO-SMD = smd 1.4 x 0.4: D+ 2.85,0; D- 2.85,0.65; GND 2.85,-1.3; ID 2.85,-0.65; VBUS 2.85,1.3 | smd 1.9 x 2: P$6 0,1.25; P$7 0,-1.25 | smd 1.9 x 2.2: P$8 0,4; P$9 0,-4
SOD-123 = smd 0.9 x 0.95: A 1.575,0; C -1.575,0
KMR2 = smd 1 x 1: 1 2,0.8; 2 2,-0.8; 3 -2,0.8; 4 -2,-0.8
L1812 = smd 1.9 x 3.4: 1 -1.95,0; 2 1.95,0
HEAD17-NOSS = drill 0.914 pad 1.575 square: 1 0,0 | drill 0.914 pad 1.575: 2 2.54,0; 3 5.08,0; 4 7.62,0; 5 10.16,0; 6 12.7,0; 7 15.24,0; 8 17.78,0; 9 20.32,0; 10 22.86,0; 11 25.4,0; 12 27.94,0; 13 30.48,0; 14 33.02,0; 15 35.56,0; 16 38.1,0; 17 40.64,0
HEAD17-NOSS-1 = drill 0.914 pad 1.575: 1 0,0; 2 2.54,0; 3 5.08,0; 4 7.62,0; 5 10.16,0; 6 12.7,0; 7 15.24,0; 8 17.78,0; 9 20.32,0; 10 22.86,0; 11 25.4,0; 12 27.94,0; 13 30.48,0; 14 33.02,0; 15 35.56,0; 16 38.1,0; 17 40.64,0
CHIP-LED0603 = smd 0.8 x 0.8: A 0,-0.75; C 0,0.75
0805 = smd 1.2 x 1: 1 -1.1,0; 2 1.1,0
PAD-JUMPER-3-NO_YES_SILK = smd 0.635 x 1.27: 1 -0.813,0; 2 0,0; 3 0.813,0
PRQC = smd 0.4 x 2: P$1 -1.2,0; P$2 0,0; P$3 1.2,0
R0402 = smd 0.7 x 0.9: 1 -0.65,0; 2 0.65,0
EXBV4V = smd 0.45 x 0.7: 1 -0.4,-0.775; 2 0.4,-0.775; 3 0.4,0.775; 4 -0.4,0.775
PAD-JUMPER-2-NC_BY_TRACE_YES_SILK = smd 0.635 x 1.27: 1 -0.508,0; 2 0.508,0
TP15SQ = smd 1.5 x 1.5: TP 0,0
QFN48 = smd 0.95 x 0.3: 1 -3.45,2.75; 2 -3.45,2.25; 3 -3.45,1.75; 4 -3.45,1.25; 5 -3.45,0.75; 6 -3.45,0.25; 7 -3.45,-0.25; 8 -3.45,-0.75; 9 -3.45,-1.25; 10 -3.45,-1.75; 11 -3.45,-2.25; 12 -3.45,-2.75; 25 3.45,-2.75; 26 3.45,-2.25; 27 3.45,-1.75; 28 3.45,-1.25; 29 3.45,-0.75; 30 3.45,-0.25; 31 3.45,0.25; 32 3.45,0.75; 33 3.45,1.25; 34 3.45,1.75; 35 3.45,2.25; 36 3.45,2.75 | smd 0.3 x 0.95: 13 -2.75,-3.45; 14 -2.25,-3.45; 15 -1.75,-3.45; 16 -1.25,-3.45; 17 -0.75,-3.45; 18 -0.25,-3.45; 19 0.25,-3.45; 20 0.75,-3.45; 21 1.25,-3.45; 22 1.75,-3.45; 23 2.25,-3.45; 24 2.75,-3.45; 37 2.75,3.45; 38 2.25,3.45; 39 1.75,3.45; 40 1.25,3.45; 41 0.75,3.45; 42 0.25,3.45; 43 -0.25,3.45; 44 -0.75,3.45; 45 -1.25,3.45; 46 -1.75,3.45; 47 -2.25,3.45; 48 -2.75,3.45 | smd 5.5 x 5.5: GND_PAD 0,0
SOT223 = smd 1.219 x 2.235: 1 -2.311,-3.099; 2 0,-3.099; 3 2.311,-3.099 | smd 3.6 x 2.2: 4 0,3.099
QFN32 = smd 0.7 x 0.3: 1 -2.3,1.75; 2 -2.3,1.25; 3 -2.3,0.75; 4 -2.3,0.25; 5 -2.3,-0.25; 6 -2.3,-0.75; 7 -2.3,-1.25; 8 -2.3,-1.75; 17 2.3,-1.75; 18 2.3,-1.25; 19 2.3,-0.75; 20 2.3,-0.25; 21 2.3,0.25; 22 2.3,0.75; 23 2.3,1.25; 24 2.3,1.75 | smd 0.3 x 0.7: 9 -1.75,-2.3; 10 -1.25,-2.3; 11 -0.75,-2.3; 12 -0.25,-2.3; 13 0.25,-2.3; 14 0.75,-2.3; 15 1.25,-2.3; 16 1.75,-2.3; 25 1.75,2.3; 26 1.25,2.3; 27 0.75,2.3; 28 0.25,2.3; 29 -0.25,2.3; 30 -0.75,2.3; 31 -1.25,2.3; 32 -1.75,2.3 | smd 3.53 x 3.53: 33 0,0
SOIC-8 = smd 0.7 x 2.2: 1 -1.905,-2.75; 2 -0.635,-2.75; 3 0.635,-2.75; 4 1.905,-2.75; 5 1.905,2.75; 6 0.635,2.75; 7 -0.635,2.75; 8 -1.905,2.75
SWRA117D_RIGHT = smd 0.813 x 0.406: GND -0.45,0.25 | smd 0.508 x 1.016: RF -2.55,0.5
FIDUCIA-MOUNT = smd 1.016 x 1.016: P$1 0,0
FIDUCIAL-1X2 = smd 1 x 1: 1 0,0
CRYSTAL-3.2-2.5 = smd 1.3 x 1.05: 1 -1.15,-0.925; 2 1.15,-0.925; 3 1.15,0.925; 4 -1.15,0.925
CRYSTAL-32KHZ-SMD_EPSON_MC146 = smd 1.2 x 0.6: NC1 6.9,1.2; NC2 6.9,0.3; P$1 0.6,0.3; P$2 0.6,1.2
CT/CN0603 = smd 1 x 1: 1 -1,0; 2 1,0

### Placement (x,y rotation side)
C1  7.11,17.14 0 bottom
C2  12.7,16.76 270 top
C3  12.57,11.18 90 bottom
C4  14.22,11.18 90 bottom
C5  14.22,16.76 270 top
C6  12.7,17.27 270 bottom
C7  10.67,21.84 0 bottom
C8  13.72,2.54 270 bottom
C9  3.56,2.54 270 bottom
C10  10.67,20.32 0 bottom
C11  14.22,22.86 270 top
C12  14.22,19.56 270 top
C13  9.14,28.83 90 top
C14  10.67,23.37 0 bottom
C15  8.13,16.89 270 top
C16  10.79,38.86 270 top
C17  13.34,36.2 180 top
C18  12.45,49.78 270 top
C19  6.6,38.1 90 bottom
C20  11.18,16.76 270 top
C21  11.68,28.83 90 top
C22  3.56,20.83 270 top
C23  7.11,23.37 180 bottom
C24  7.11,21.84 180 bottom
C25  12.7,45.21 270 bottom
C26  9.65,45.21 270 bottom
C27  6.48,45.97 180 top
C28  6.48,42.93 180 top
C29  14.73,45.72 270 top
CN1  8.89,2.03 90 top
D1  5.08,6.6 270 bottom
D2  13.72,34.04 90 bottom
ERASE  5.59,34.04 0 top
F1  9.14,2.54 0 bottom
J5  1.27,44.45 270 top
J6  16.51,44.45 270 top
L  6.6,14.73 0 top
L1  14.22,17.27 90 bottom
LOAD/OTA  4.83,40.64 0 top
ON  5.08,14.73 0 top
Q1  9.65,14.22 0 top
R1  12.19,31.5 0 top
R2  5.08,2.54 90 bottom
R3  14.73,49.78 90 top
R5  5.08,12.19 90 top
R7  3.56,43.18 90 top
R8  6.6,12.19 90 top
R9  5.59,36.32 0 top
R10  5.08,49.28 180 bottom
R11  8.13,50.8 180 bottom
R13  13.72,38.1 90 bottom
R14  8.13,49.28 180 bottom
RESET  12.19,34.04 0 top
RN1  8.89,6.99 0 top
RST  9.14,49.78 180 top
RX  3.56,45.72 180 top
TP3  5.08,50.8 270 bottom
U1  8.89,22.86 180 top
U2  7.11,12.7 270 bottom
U5  11.18,45.21 270 top
U6  10.16,37.08 180 bottom
U$1  [LOGO-SM]  17.14,46.99 0 bottom
U$11  14.99,52.07 0 top
U$12  [OSHW-LOGO-S]  3.17,53.98 0 bottom
U$37  5.08,6.73 0 top
U$53  3.17,45.47 0 bottom
Y1  13.34,38.86 90 top
Y2  3.05,30.48 0 top
Z1  9.65,6.6 90 bottom
Z2  7.62,6.6 90 bottom

### Tracks (layer width: path | path; a pad name or v marks a point on that pad's centre or on a via)
3V3  (via drill 0.25)
  Top 0.127: ERASE.1 7.59,36.54 v8.13,37.08 | ERASE.3 4.36,34.84 v4.57,35.05 | R1.1 11.54,32.37 v11.68,32.51 | R5.1 5.08,10.67 v4.57,10.16 | RX.A v3.56,47.37
  Top 0.305: U1.13 11.68,26.31 11.68,27.05 v11.94,27.3 11.68,27.56 C21.1 | U1.7 13.2,23.11 v13.34,23.24 14.11,23.24 C11.1 | U1.47 11.14,18.45 v11.18,18.41 C20.1 | U1.33 4.46,21.61 v4.45,21.46 4.45,21.59 3.67,21.59 C22.1 | U5.17 8.27,42.91 v8.26,42.93 C28.1 | v8,45.97 8.14,45.96 U5.11 7.27,45.96 C27.1 | U5.14 8.14,44.46 v8,44.45 | U5.29 U5.30 14.32,45.96 C29.1 14.75,46.37 14.86,46.48 v14.86,47.12 | U5.1 12.97,47.51 v13.72,48.26 | U5.3 U5.4 11.43,48.39 10.67,49.15 v10.67,49.28
  Bottom 0.127: R10.2 v6.6,49.28 R14.1 R11.1
  Bottom 0.305: v8.26,42.93 8.26,42.8 | C26.1 8.22,46.06 v8,45.97 | C25.1 14.42,46.06 C29.1 14.75,46.37 14.86,46.48 v14.86,47.12 | C19.1 7.76,37.45 v8.13,37.08 8.26,36.96 U6.8 | C1.1 7.96,13.88 8.13,13.72 | 8.13,13.72 9.14,12.7 U2.2 | C7.1 12.06,21.84 12.45,22.23 12.45,22.86 12.7,23.11 v13.34,23.24 | C10.1 11.52,18.76 v11.18,18.41 | v4.45,21.46 4.7,21.84 C24.1 C23.1 | U2.4 4.01,10.72 v4.57,10.16 | v7.62,12.7 7.62,13.21 8.13,13.72
  pour PWR (isolate 0.127): -1.27,52.07 19.05,52.07 19.05,-1.27 -1.27,-1.27
A0  (via drill 0.25)
  Top 0.127: v14.48,24.51 13.08,24.51 12.68,24.11 U1.9
  PWR 0.127: J6.14 15.24,12.7 15.24,14.35 14.99,14.61 14.99,17.14 14.73,17.4 14.73,24.26 v14.48,24.51
A1  (via drill 0.25)
  Top 0.127: v14.73,25.27 13.84,25.27 13.46,24.89 13.08,24.89 12.8,24.61 U1.10
  PWR 0.127: J6.13 16,13.97 15.24,14.73 15.24,17.27 14.99,17.53 14.99,25.15 14.86,25.27 v14.73,25.27
A2  (via drill 0.25)
  Top 0.127: v14.73,26.04 14.22,26.04 13.34,25.15 12.38,25.15 U1.11
  PWR 0.127: J6.12 15.24,17.78 15.24,25.53 v14.73,26.04
A3  (via drill 0.25)
  Top 0.127: v14.73,26.8 13.08,26.8 12.34,26.06 U1.12
  PWR 0.127: J6.11 16.38,19.05 15.49,19.94 15.49,26.29 14.99,26.8 v14.73,26.8
A4
  Top 0.127: U1.3 12.67,21.11 12.7,21.08 12.83,21.08 12.95,20.95 15.88,20.95 J6.10
A5
  Top 0.127: U1.4 12.68,21.61 13.08,21.21 15.24,21.21 15.49,21.46 15.49,23.11 J6.9
AREF
  Top 0.127: U1.1 13.15,20.11 C12.2 14.37,18.91 15.24,18.03 15.24,10.16 J6.15
CHIP_EN  (via drill 0.25)
  Top 0.127: U5.7 9.93,47.99 v9.65,48.26 | U1.15 10.64,26.82 10.41,27.05 10.41,28.45 10.79,28.83 10.79,29.59 v10.67,29.72
  GND 0.127: v10.67,29.72 10.67,29.84 10.54,29.97 10.54,41.53 10.67,41.66 10.67,42.67 9.91,43.43 9.91,48.01 v9.65,48.26
  Bottom 0.127: v9.65,48.26 9.65,49.93 R11.2
D0/RX  (via drill 0.25)
  Top 0.127: v14.22,43.18 14.22,43.56 13.84,43.94 13.5,43.94 U5.26 | U1.22 7.14,26.9 6.99,27.05 6.99,28.07 6.6,28.45 v6.1,28.45
  PWR 0.127: J5.4 1.27,35.69 2.16,34.8 2.16,29.34 3.05,28.45 v6.1,28.45
  Bottom 0.127: J5.4 6.1,41.66 8.64,41.66 9.65,42.67 12.7,42.67 13.21,42.16 13.97,42.16 14.35,42.55 14.35,43.05 v14.22,43.18
D1/TX  (via drill 0.25)
  Top 0.127: v13.59,42.8 13.59,43.31 13.46,43.43 13.46,43.45 U5.25 | U1.21 7.64,26.9 7.37,27.18 7.37,28.19 6.6,28.96 v5.59,28.96
  PWR 0.127: v5.59,28.96 3.3,28.96 2.54,29.72 2.54,38.1 J5.3
  Bottom 0.127: J5.3 3.3,39.37 6.1,42.16 8.64,42.16 9.65,43.18 13.21,43.18 v13.59,42.8
D2/SDA  (via drill 0.25)
  Top 0.127: U1.31 4.95,22.61 4.82,22.74 3.68,22.74 v2.54,23.88
  PWR 0.127: v2.54,23.88 2.54,27.94 J5.7
D3/SCL  (via drill 0.25)
  Top 0.127: U1.28 3.83,24.11 J5.8 | LOAD/OTA.3 5.59,40.59 5.59,38.61 v5.08,38.1
  Bottom 0.127: J5.8 2.54,27.94 2.54,35.56 v5.08,38.1
D4  (via drill 0.25)
  Top 0.127: U1.6 13.2,22.61 v13.34,22.48 | v3.17,22.35 3.05,22.35 J5.9
  GND 0.127: v13.34,22.48 13.21,22.35 6.1,22.35 5.71,22.73 3.56,22.73 v3.17,22.35
D5  (via drill 0.25)
  Top 0.127: U1.25 3.35,25.61 v3.05,25.91
  PWR 0.127: v3.05,25.91 3.05,23.37 J5.10
D6  (via drill 0.25)
  Top 0.127: U1.5 12.69,22.11 13.08,21.72 v13.34,21.72 | v3.56,19.05 J5.11
  GND 0.127: v13.34,21.72 6.22,21.72 v3.56,19.05
D9  (via drill 0.25)
  Top 0.127: v4.32,24.64 5.41,24.64 U1.27
  PWR 0.127: J5.14 1.27,12.57 2.16,13.46 2.16,22.1 2.92,22.86 3.56,22.86 3.68,22.73 4.83,22.73 5.08,22.99 5.08,23.88 v4.32,24.64
D10  (via drill 0.25)
  Top 0.127: v4.19,22.23 4.83,22.23 4.95,22.1 4.96,22.11 U1.32
  PWR 0.127: J5.15 1.27,10.16 2.41,11.3 2.41,20.83 3.81,22.23 v4.19,22.23
D11  (via drill 0.25)
  Top 0.127: U1.35 4.86,20.61 4.57,20.32 4.57,18.29 3.81,17.53 v3.05,17.53
  PWR 0.127: J5.16 1.27,7.62 2.67,9.02 2.67,17.14 v3.05,17.53
D12  (via drill 0.25)
  Top 0.127: v8,27.3 8.13,27.18 8.13,26.32 U1.20
  PWR 0.127: J5.17 1.27,5.08 2.92,6.73 2.92,16.38 3.56,17.02 3.56,17.78 3.05,18.29 3.05,19.3 8.13,24.38 8.13,27.18 v8,27.3
D13
  Top 0.127: J6.17 8.78,11.54 R8.1 6.37,11.54 5.84,12.06 5.84,16 5.44,16.4 5.46,16.64 5.08,17.02 5.08,19.81 5.38,20.11 U1.36
D+  (via drill 0.25)
  Top 0.127: CN1.D+ 8.89,5.59 9.29,5.99 RN1.2 9.68,6.6 v10.16,6.6
  Bottom 0.127: Z1.1 9.65,6.1 v10.16,6.6
D-  (via drill 0.25)
  Top 0.127: CN1.D- 8.24,5.96 RN1.1 8.1,6.6 v7.62,6.6
  Bottom 0.127: Z2.1 v7.62,6.6
ERASE  (via drill 0.25)
  Top 0.127: ERASE.4 ERASE.2 | R9.2 6.24,34.59 ERASE.2 | ERASE.2 8.17,33.24 v8.64,32.77 | 12.7,30.23 8.89,30.23 v8.64,30.48 | 12.7,30.23 15.49,30.23 J6.7 | U1.42 8.64,18.55 v8.64,18.41 | v13.21,27.43 13.21,29.72 12.7,30.23
  PWR 0.127: v8.64,18.41 8.64,18.29 8.13,17.78 7.62,17.78 7.37,18.03 7.37,19.18 13.21,25.02 v13.21,27.43
  Bottom 0.127: v8.64,32.77 v8.64,30.48
GND  (via drill 0.25)
  Top 0.127: U1.34 4.85,21.11 4.57,20.83
  Top 0.305: R3.2 14.73,51.31
  Top 0.813: U$11.GND 14.54,51.63 14.73,51.44
  other vias: 10.67,45.72 11.68,45.72 10.67,44.7 11.68,44.7 11.18,45.21 16.26,20.32 7.87,45.21 14.61,27.94 4.32,23.24 4.06,36.07 7.11,39.62 12.57,28.45 4.95,16.38 9.4,16.89 11.56,49.15 11.56,49.66 11.56,50.16 11.56,50.67 11.56,51.18 11.56,51.69 13.34,49.66 13.34,50.16 13.34,50.67 13.34,51.18 13.34,51.69 6.48,30.48 1.4,20.32
  pour Bottom (isolate 0.127): 19.68,52.07 -1.91,52.07 -1.91,-1.91 19.68,-1.91
  pour Top (isolate 0.127): -2.54,52.07 20.32,52.07 20.32,-2.54 -2.54,-2.54
  pour GND (isolate 0.127): -0.64,52.07 18.41,52.07 18.41,-0.64 -0.64,-0.64
MISO  (via drill 0.25)
  Top 0.127: v8.26,28.32 8.26,27.81 8.64,27.43 U1.19
  GND 0.127: J6.2 15.24,40.64 15.24,33.02 10.67,28.45 8.38,28.45 v8.26,28.32
MOSI  (via drill 0.25)
  Top 0.127: U1.17 9.64,27.04 9.91,27.3 9.91,28.57 9.65,28.83 7.24,28.83 6.6,29.46 v5.08,29.46
  PWR 0.127: v5.08,29.46 3.43,29.46 2.92,29.97 2.92,42.8 J5.1
N$1
  Top 0.127: Y2.P$2 4.39,31.68 4.57,31.5 4.57,27.94 5.08,27.43 6.1,27.43 6.64,26.89 U1.23
N$2
  Top 0.127: R7.2 RX.C
N$3
  Top 0.127: ON.A R5.2
N$5
  Top 0.127: Y2.P$1 3.65,27.34 4.68,26.31 U1.24
N$6  (via drill 0.25)
  Top 0.127: U5.15 4.81,43.96 v4.57,44.2 4.83,43.94 LOAD/OTA.2
  Bottom 0.127: TP3.TP 4.43,50.15 R10.1 4.57,49.13 v4.57,44.2
N$7
  Top 0.127: R8.2 L.A
N$27
  Top 0.127: C17.1 13.98,37.95 Y1.1 13.34,38.64 13.34,40.77 15.37,42.8 15.37,43.31 13.97,44.7 13.97,44.83 13.84,44.96 U5.28
N$28
  Top 0.127: C16.1 11.91,39.51 Y1.3 12.41,40.6 12.45,40.26 14.99,42.84 14.99,43.31 13.83,44.46 U5.27
N$31
  Top 0.406: U$11.RF 12.44,50.44 C18.1
N$32
  Top 0.127: U5.31 13.7,46.46 14.1,46.86 14.1,47.12 15.24,48.26 15.24,48.77 14.87,49.13 R3.1
N$33  (via drill 0.25)
  Top 0.127: U5.32 13.48,47.13 14.48,48.13 v14.48,48.26 | v10.16,48.77 10.16,49.28 RST.1
  Bottom 0.127: v14.48,48.26 13.97,47.75 11.18,47.75 v10.16,48.77
N$34  (via drill 0.25)
  Top 0.127: v11.43,42.04 U5.21
  Bottom 0.127: v11.43,42.04 11.43,38.61 11.8,38.24 13.21,38.24 R13.2
N$35
  Bottom 0.127: U6.6 10.79,36.7 11.54,37.45 R13.1
N$36  (via drill 0.25)
  Top 0.127: U5.20 10.93,41.66 10.67,41.4 v9.65,41.4
  Bottom 0.127: v9.65,41.4 8.89,41.4 8.26,40.77 U6.1
N$37  (via drill 0.25)
  Top 0.127: U5.18 9.93,42.44 8.64,41.15 8.64,37.59 9.14,37.08 v9.14,36.58
  Bottom 0.127: v9.14,36.58 9.14,36.07 9.53,35.69 U6.7
N$38  (via drill 0.25)
  Top 0.127: U5.19 10.43,42.18 v10.16,41.91
  Bottom 0.127: v10.16,41.91 10.16,40.47 U6.3
N$39  (via drill 0.25)
  Top 0.127: U5.23 12.43,41.89 10.92,40.39 10.54,40.39 10.03,39.88 10.03,37.47 11.3,36.2 v11.81,36.2
  Bottom 0.127: v11.81,36.2 11.81,34.59 U6.5
N$40  (via drill 0.25)
  Top 0.127: U5.22 11.93,41.77 10.92,40.77 10.29,40.77 9.53,40.01 v9.53,38.1
  Bottom 0.127: U6.2 v9.53,38.1
N$45
  Top 0.305: U5.2 12.43,49.11 C18.2
RD+  (via drill 0.25)
  Top 0.127: U1.44 v9.64,18.3 v9.65,18.29 | v9.65,8.64 9.65,8.12 RN1.3
  PWR 0.127: v9.65,18.29 9.65,17.78 10.16,17.27 10.16,16.26 9.65,15.75 v9.65,8.64
RD-  (via drill 0.25)
  Top 0.127: U1.43 v9.14,17.78 | v8.64,8.64 8.64,7.91 RN1.4
  PWR 0.127: v9.14,17.78 8.64,17.27 8.64,16.26 9.14,15.75 9.14,9.14 v8.64,8.64
RESET  (via drill 0.25)
  Top 0.127: RESET.2 15.46,33.24 J6.5 | 2.79,32.26 8.89,32.26 9.87,33.24 RESET.4 RESET.2 | 2.79,32.26 1.27,33.78 J5.5 2.54,35.56 2.54,39.62 3.56,40.64 LOAD/OTA.1 | RESET.2 14.19,31.97 13.72,31.5 R1.2 | 2.79,32.26 2.79,27.18 v3.56,26.42 | v3.56,23.62 3.94,23.62 4.06,23.75 4.7,23.75 4.83,23.62 5.43,23.62 U1.29
  PWR 0.127: v3.56,26.42 v3.56,23.62
RXTXLED/SS  (via drill 0.25)
  Top 0.127: J5.2 1.89,42.53 R7.1 v3.56,41.66 | U1.14 11.14,27.21 v10.92,27.43 | v7.62,29.84 5.71,29.84 5.08,30.48 v5.08,31.5
  PWR 0.127: v10.92,27.43 8.38,29.84 v7.62,29.84 | v5.08,31.5 3.3,33.27 3.3,41.4 v3.56,41.66
SCK  (via drill 0.25)
  Top 0.127: v10.29,29.08 10.16,28.96 10.16,26.33 U1.16
  GND 0.127: J6.1 16,44.45 14.73,43.18 14.73,33.02 10.79,29.08 v10.29,29.08
SWCLK/D8  (via drill 0.25)
  Top 0.127: U1.40 7.64,19.07 7.11,18.54 v6.86,18.16
  Bottom 0.127: v6.86,18.16 6.6,17.91 4.19,17.91 2.03,15.75 2.03,14.73 J5.13
SWDIO/D7  (via drill 0.25)
  Top 0.127: U1.39 7.14,19.08 6.73,18.67 v6.1,18.41
  Bottom 0.127: v6.1,18.41 5.97,18.29 3.05,18.29 J5.12
SWO/ESP_RST  (via drill 0.25)
  Top 0.127: U5.8 8.37,47.51 v8.13,47.75 8.13,49.28 RST.2 | U1.37 6.14,19.35 v5.59,18.92
  PWR 0.127: J6.8 15.62,27.56 15.62,28.07 | 15.62,28.07 15.62,46.23 15.37,46.48 15.37,48.39 14.86,48.9 13.84,48.9 13.72,48.77 11.94,48.77 10.92,47.75 v8.13,47.75 | 15.62,28.07 15.24,28.45 13.46,28.45 12.7,27.69 12.7,24.89 7.11,19.3 5.97,19.3 v5.59,18.92
  Bottom 0.127: v8.13,47.75 8.13,48.77 8.64,49.28 8.64,49.13 R14.2
VCC
  Bottom 0.305: D1.C 5.08,9.14 6.33,10.39 U2.3 10.27,10.33 C3.1 C4.1 15.24,11.34 15.24,24.64 15.37,24.77 15.37,27.18 15.24,27.3 15.24,30.48 14.99,30.73 | D2.C 13.72,32 14.99,30.73 | J6.6 16,31.75 14.99,30.73
VDDOUT  (via drill 0.25)
  Top 0.305: U1.18 v9.14,27.3 C13.1 | U1.41 8.13,18.92 7.87,18.67 v7.87,18.41 7.87,17.8 C15.1 | U1.8 12.81,23.61 13.21,24 v13.34,24
  GND 0.305: v14.22,15.11 9.53,15.11 7.87,16.76 v7.87,18.41
  PWR 0.305: v7.87,18.41 7.87,19.05 12.83,24 v13.34,24
  Bottom 0.305: v9.14,27.3 9.14,25.4 9.65,24.89 10.67,24.89 11.52,24.04 C14.1 12.03,23.88 v13.34,24 | L1.1 v14.22,15.11
VDDPLL  (via drill 0.25)
  Top 0.305: U1.48 12.09,19.41 v12.32,19.18 12.7,18.8 C2.1 C5.1
  Bottom 0.305: v12.32,19.18 12.7,18.8 C6.1 12.95,18.37 L1.2
VIN
  Bottom 0.305: J6.3 16.51,38.86 13.72,36.07 D2.A
VUSB
  Bottom 0.305: D1.A R2.2 | R2.2 3.76,3.19 C9.1 | R2.2 6.54,3.19 F1.2
VUSBD  (via drill 0.25)
  Top 0.305: CN1.VBUS 6.8,4.88 v6.6,5.08
  Bottom 0.305: C8.1 11.94,3.39 F1.1 9.06,4.57 7.11,4.57 v6.6,5.08
XTAL1
  Top 0.127: U1.46 10.64,18.89 10.41,18.67 10.41,14.66 Q1.P$3
XTAL2
  Top 0.127: U1.45 10.14,16.87 8.45,15.18 Q1.P$1

### Text on the board
tPlace: MOSI | SCK | SS | MISO | TX1 | VIN | RX1 | GND | RST | RST | GND | V+ | RX | D2 | ERASE | rst | D3 | D4 | # | A5 | # | D5 | A4 | D6 | # | A3 | D7 | A2 | D8 | A1 | TX | # | D9 | A0 | D10 | # | REF | # | D11 | 3V3 | D12 | # | # | D13
tNames: Arachnio r1 / (c) 2015 / CC-BY-SA-3.0